# EAGLE schematic Z05_C8V_01 (EAGLE 6.3)
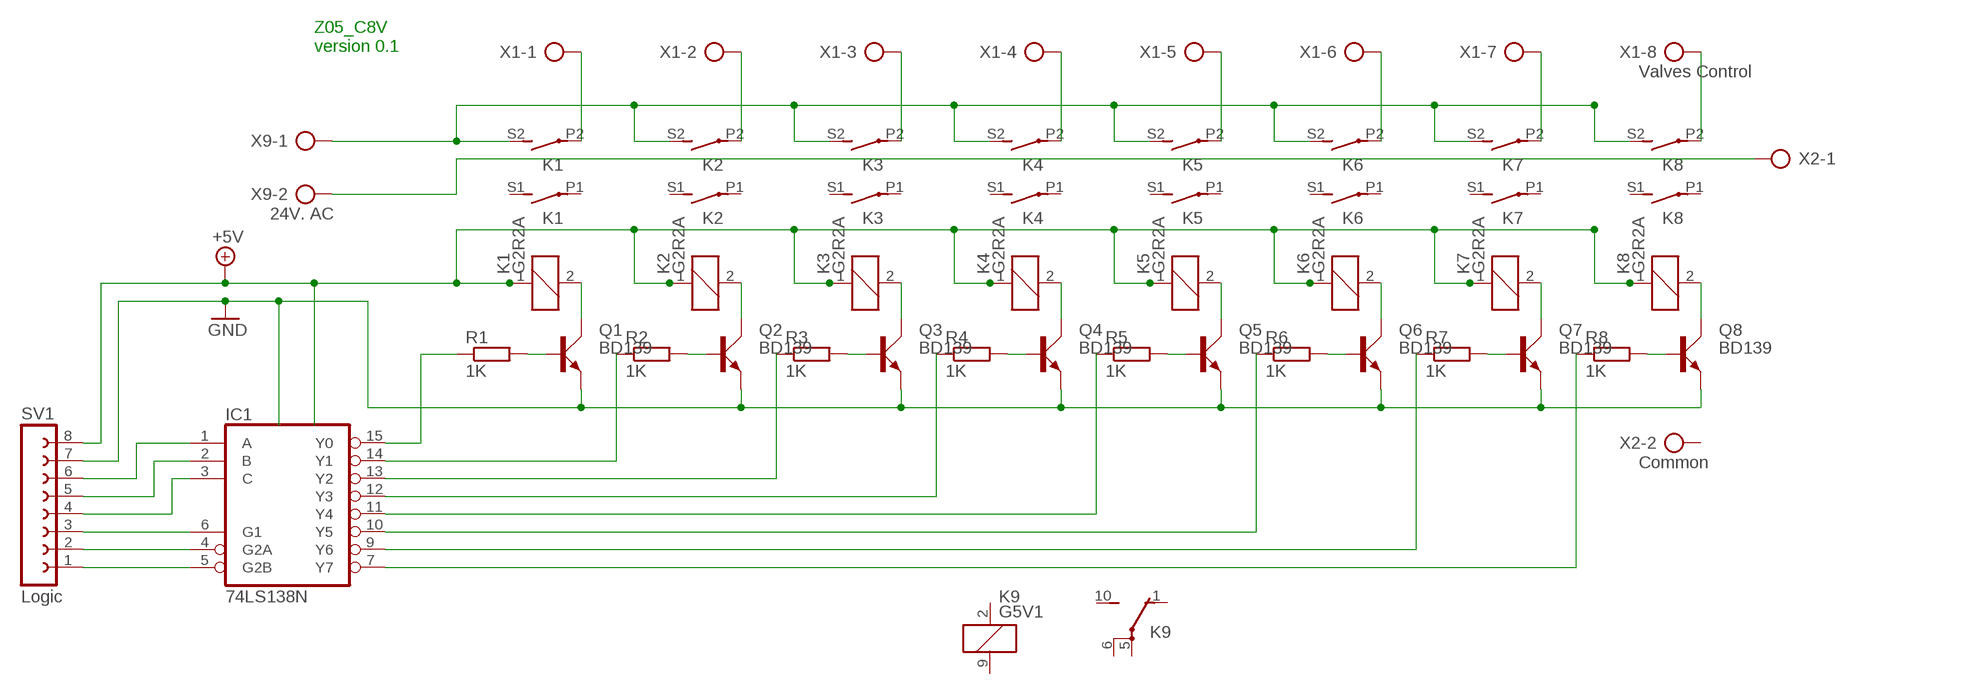
[diagram p0: schematic, sheet 1]

## Parts
IC1  74LS138N  [DIL16]
K1  G2R2A  [G2R2A]
K2  G2R2A  [G2R2A]
K3  G2R2A  [G2R2A]
K4  G2R2A  [G2R2A]
K5  G2R2A  [G2R2A]
K6  G2R2A  [G2R2A]
K7  G2R2A  [G2R2A]
K8  G2R2A  [G2R2A]
K9  G5V1  [G5V1]
Q1  BD139  [TO126AV]
Q2  BD139  [TO126AV]
Q3  BD139  [TO126AV]
Q4  BD139  [TO126AV]
Q5  BD139  [TO126AV]
Q6  BD139  [TO126AV]
Q7  BD139  [TO126AV]
Q8  BD139  [TO126AV]
R1  1K  R-EU_0204/7  [0204/7]
R2  1K  R-EU_0204/7  [0204/7]
R3  1K  R-EU_0204/7  [0204/7]
R4  1K  R-EU_0204/7  [0204/7]
R5  1K  R-EU_0204/7  [0204/7]
R6  1K  R-EU_0204/7  [0204/7]
R7  1K  R-EU_0204/7  [0204/7]
R8  1K  R-EU_0204/7  [0204/7]
SV1  Logic  FE08-1  [FE08]
X1  Valves Control  AK300/8  [AK300/8]
X2  Common  AK300/2  [AK300/2]
X9  24V. AC  AK300/2  [AK300/2]

## Nets
+5V: K1.1 K2.1 K3.1 K4.1 K5.1 K6.1 K7.1 K8.1 SV1.8
GND: Q1.E Q2.E Q3.E Q4.E Q5.E Q6.E Q7.E Q8.E SV1.7
N$1: K1.S2(3:S) K2.S2(3:S) K3.S2(3:S) K4.S2(3:S) K5.S2(3:S) K6.S2(3:S) K7.S2(3:S) K8.S2(3:S) X9.1
N$2: X2.1 X9.2
N$3: Q1.B R1.2
N$4: IC1.15(Y0) R1.1
N$5: K1.2 Q1.C
N$6: K5.P2(3:P) X1.5
N$7: K2.P2(3:P) X1.2
N$8: Q2.B R2.2
N$9: K2.2 Q2.C
N$10: K3.P2(3:P) X1.3
N$11: K4.P2(3:P) X1.4
N$12: Q3.B R3.2
N$13: K3.2 Q3.C
N$14: K6.P2(3:P) X1.6
N$15: K7.P2(3:P) X1.7
N$16: Q4.B R4.2
N$17: K4.2 Q4.C
N$18: K8.P2(3:P) X1.8
N$20: Q5.B R5.2
N$21: K5.2 Q5.C
N$24: Q6.B R6.2
N$25: K6.2 Q6.C
N$27: IC1.14(Y1) R2.1
N$28: Q7.B R7.2
N$29: K7.2 Q7.C
N$30: IC1.13(Y2) R3.1
N$31: IC1.12(Y3) R4.1
N$32: Q8.B R8.2
N$33: K8.2 Q8.C
N$34: IC1.11(Y4) R5.1
N$35: IC1.10(Y5) R6.1
N$36: IC1.9(Y6) R7.1
N$37: IC1.7(Y7) R8.1
N$42: IC1.1(A) SV1.6
N$43: IC1.2(B) SV1.5
N$44: IC1.3(C) SV1.4
N$45: IC1.6(G1) SV1.3
N$46: IC1.4(G2A) SV1.2
N$47: IC1.5(G2B) SV1.1
N$54: K1.P2(3:P) X1.1
Unconnected: K1.P1(2:P) K1.S1(2:S) K2.P1(2:P) K2.S1(2:S) K3.P1(2:P) K3.S1(2:S) K4.P1(2:P) K4.S1(2:S) K5.P1(2:P) K5.S1(2:S) K6.P1(2:P) K6.S1(2:S) K7.P1(2:P) K7.S1(2:S) K8.P1(2:P) K8.S1(2:S) K9.1(2:O) K9.2 K9.5(2:P) K9.6(2:P) K9.9 K9.10(2:S) X2.2

## Notes on the sheet
- Z05_C8V
  version 0.1

## Power pins joined to a net without a drawn wire
GND: IC1.8(GND)
VCC: IC1.16(VCC)

## Library data of the parts
IC1 = 74xx-eu:74*138: 3-line to 8-line DECODER/DEMULTIPLEXER
K1-K8 = relay:G2R2A: RELAY 2 x norm. open, Omron; MPN: G2R-2A-DC24; OC_FARNELL: 6985269; OC_NEWARK: 36M5257
K9 = relay:G5V1: RELAY 1 x switch, 0.5 A/125 V AC, 1 A/24 V DC , Omron; MPN: G5V-1-DC24; OC_FARNELL: 9949593; OC_NEWARK: 36M6377
Q1-Q8 = transistor-power:BD139: NPN TRANSISTOR
R1-R8 = rcl:R-EU_: RESISTOR, European symbol
SV1 = con-lsta:FE08-1: FEMALE HEADER; OC_FARNELL: unknown; OC_NEWARK: unknown
X1 = con-ptr500:AK300/8: CONNECTOR; OC_FARNELL: unknown; OC_NEWARK: unknown
X2 X9 = con-ptr500:AK300/2: CONNECTOR; OC_FARNELL: unknown; OC_NEWARK: unknown